# Altium schematic sheet Sheet2.SchDoc
size A; SheetNumber: 1; SheetTotal: 1
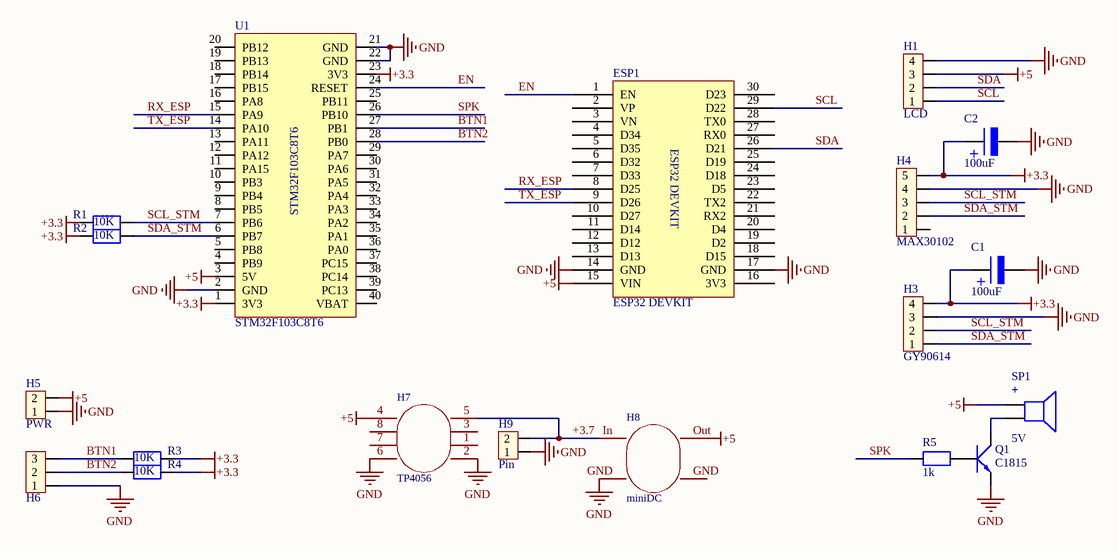
[diagram p0: Sheet2.SchDoc]

## Parts
C1  100uF  [cap - 470uF/35v]
C2  100uF  [cap - 470uF/35v]
ESP1  ESP32 DEVKIT  [ESP32]
H1  LCD  [XH2.54 4P]
H3  GY90614  [XH2.54 4P]
H4  MAX30102  [XH2.54 5P]
H5  PWR  [KF301 2P]
H6  KF301  [KF301 3P]  (value not drawn)
H7  TP4056  [HDR2X4]
H8  miniDC  [HDR2X4]
H9  Pin  [KF301 2P]
Q1  C1815  [NPN]
R1  10K  [RES]
R2  10K  [RES]
R3  10K  [RES]
R4  10K  [RES]
R5  1k  [RES]
SP1  5V  [Coi chip 5V]
U1  STM32F103C8T6  [KIT STM32F103C8T6]

## Nets
+3.3: C1.1(VCC) C2.1(VCC) H3.4 H4.5 R1.2 R2.2 R3.1 R4.1 U1.1(3V3) U1.23(3V3)
+5: ESP1.15(VIN) H1.3 H5.2 H7.4 H8.Out SP1.1 U1.3(5V)
GND: C1.2(GND) C2.2(GND) ESP1.14(GND) ESP1.17(GND) H1.4 H3.3 H4.4 H5.1 H6.1 H7.2 H7.6 H8.GND H9.1 Q1.1(E) U1.2(GND) U1.21(GND) U1.22(GND)
+3.7: H7.5 H8.In H9.2
BTN1: H6.3 R3.2 U1.27(PB1)
BTN2: H6.2 R4.2 U1.28(PB0)
EN: ESP1.1(EN) U1.24(RESET)
RX_ESP: ESP1.8(D25) U1.15(PA9)
SCL: ESP1.29(D22) H1.1
SCL_STM: H3.2 H4.3 R1.1 U1.7(PB6)
SDA: ESP1.26(D21) H1.2
SDA_STM: H3.1 H4.2 R2.1 U1.6(PB7)
SPK: R5.2 U1.26(PB10)
TX_ESP: ESP1.9(D26) U1.14(PA10)
NetQ1_2: Q1.2(C) SP1.2
NetQ1_3: Q1.3(B) R5.1

Not connected (* = marked no-connect by the designer): ESP1 2(VP) 3(VN) 4(D34) 5(D35) 6(D32) 7(D33) 10(D27) 11(D14) 12(D12) 13(D13) 16(3V3) 18(D15) 19(D2) 20(D4) 21(RX2) 22(TX2) 23(D5) 24(D18) 25(D19) 27(RX0) 28(TX0) 30(D23); H4 1; H7 1(6) 3(4) 7(5) 8(3); U1 4(PB9) 5(PB8) 8(PB5) 9(PB4) 10(PB3) 11(PA15) 12(PA12) 13(PA11) 16(PA8) 17(PB15) 18(PB14) 19(PB13) 20(PB12) 25(PB11) 29(PA7) 30(PA6) 31(PA5) 32(PA4) 33(PA3) 34(PA2) 35(PA1) 36(PA0) 37(PC15) 38(PC14) 39(PC13) 40(VBAT)

## Notes on the sheet
- (in symbol Cap1) +
- (in symbol Coi chip 5V) +

## Library data of the parts
C1 C2 = Cap1: phan cuc
ESP1 = ESP32: module
H1 H3 = HEADER 4P: Header
H4 = HEADER 5P: Header
H5 H9 = HEADER 2P: Header
H6 = HEADER 3P: Header
H7 H8 = Header 4X2: LatestRevisionDate: 17-Jul-2002; LatestRevisionNote: Re-released for DXP Platform.; Publisher: Altium Limited
Q1 = C1815: NPN
R1-R5 = Resistor: 1k, 1/4W
SP1 = Coi chip 5V: Speaker
U1 = STM32